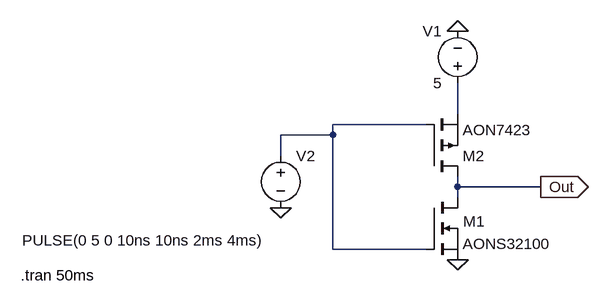
[diagram p0: schematic NOT_v2.asc]
NOT_v2.asc, the LTspice schematic file:
Version 4
SHEET 1 1092 680
WIRE 96 208 96 160
WIRE 48 224 -96 224
WIRE -96 240 -96 224
WIRE -96 240 -176 240
WIRE -176 272 -176 240
WIRE 96 320 96 304
WIRE 224 320 96 320
WIRE 96 336 96 320
WIRE -96 416 -96 240
WIRE 48 416 -96 416
FLAG 96 80 0
FLAG -176 352 0
FLAG 96 432 0
FLAG 224 320 Out
IOPIN 224 320 Out
SYMBOL voltage 96 176 R180
WINDOW 0 24 96 Left 2
WINDOW 3 24 16 Left 2
WINDOW 123 0 0 Left 0
WINDOW 39 0 0 Left 0
SYMATTR InstName V1
SYMATTR Value 5
SYMBOL nmos 48 336 R0
WINDOW 0 57 37 Left 2
SYMATTR InstName M1
SYMATTR Value AONS32100
SYMBOL voltage -176 256 R0
WINDOW 3 -398 146 Left 2
WINDOW 123 0 0 Left 0
WINDOW 39 0 0 Left 0
SYMATTR Value PULSE(0 5 0 10ns 10ns 2ms 4ms)
SYMATTR InstName V2
SYMBOL pmos 48 304 M180
SYMATTR InstName M2
SYMATTR Value AON7423
TEXT -576 456 Left 2 !.tran 50ms

The netlist it stands for:
* NOT_v2.asc
V1 N001 0 5
M1 Out N002 0 0 AONS32100
V2 N002 0 PULSE(0 5 0 10ns 10ns 2ms 4ms)
M2 Out N002 N001 N001 AON7423
.model NMOS NMOS
.model PMOS PMOS
.lib standard.mos
.tran 50ms
.backanno
.end